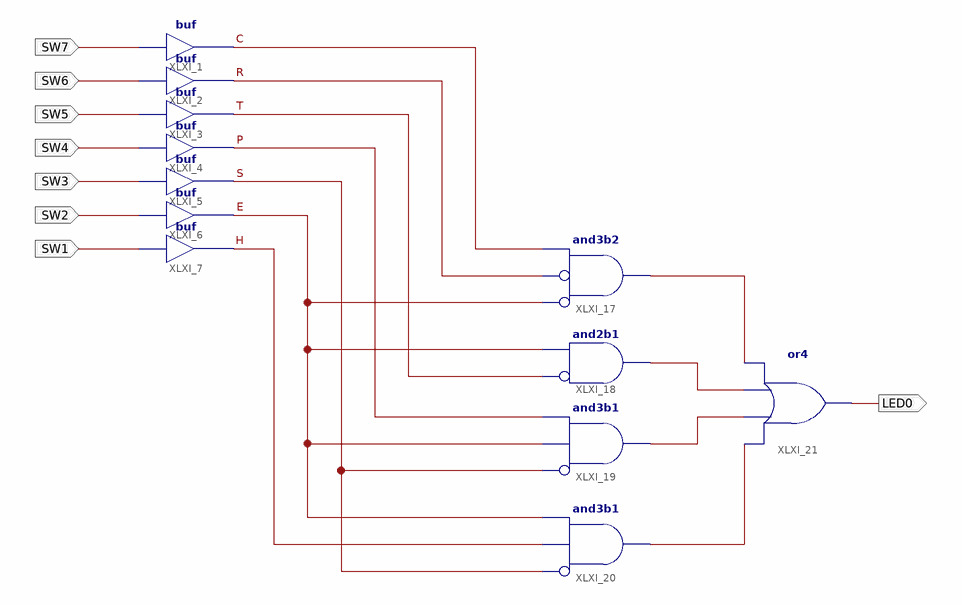
[diagram p0: schematic sheet 1]
// Xilinx ISE schematic main.sch (spartan6) as structural Verilog: 12 symbols, 8 ports
module main (
  input  SW7,
  input  SW6,
  input  SW5,
  input  SW4,
  input  SW3,
  input  SW2,
  input  SW1,
  output LED0
);

  wire C, E, H, P, R, S, T, XLXN_34, XLXN_35, XLXN_36, XLXN_37;

  buf XLXI_1 (C, SW7);
  buf XLXI_2 (R, SW6);
  buf XLXI_3 (T, SW5);
  buf XLXI_4 (P, SW4);
  buf XLXI_5 (S, SW3);
  buf XLXI_6 (E, SW2);
  buf XLXI_7 (H, SW1);
  and XLXI_17 (XLXN_34, ~E, ~R, C);  // and3b2
  and XLXI_18 (XLXN_35, ~T, E);  // and2b1
  and XLXI_19 (XLXN_36, ~S, E, P);  // and3b1
  and XLXI_20 (XLXN_37, ~S, H, E);  // and3b1
  or XLXI_21 (LED0, XLXN_37, XLXN_36, XLXN_35, XLXN_34);
endmodule
